# EasyEDA Pro project FKM3.epro, board PCB_OLD
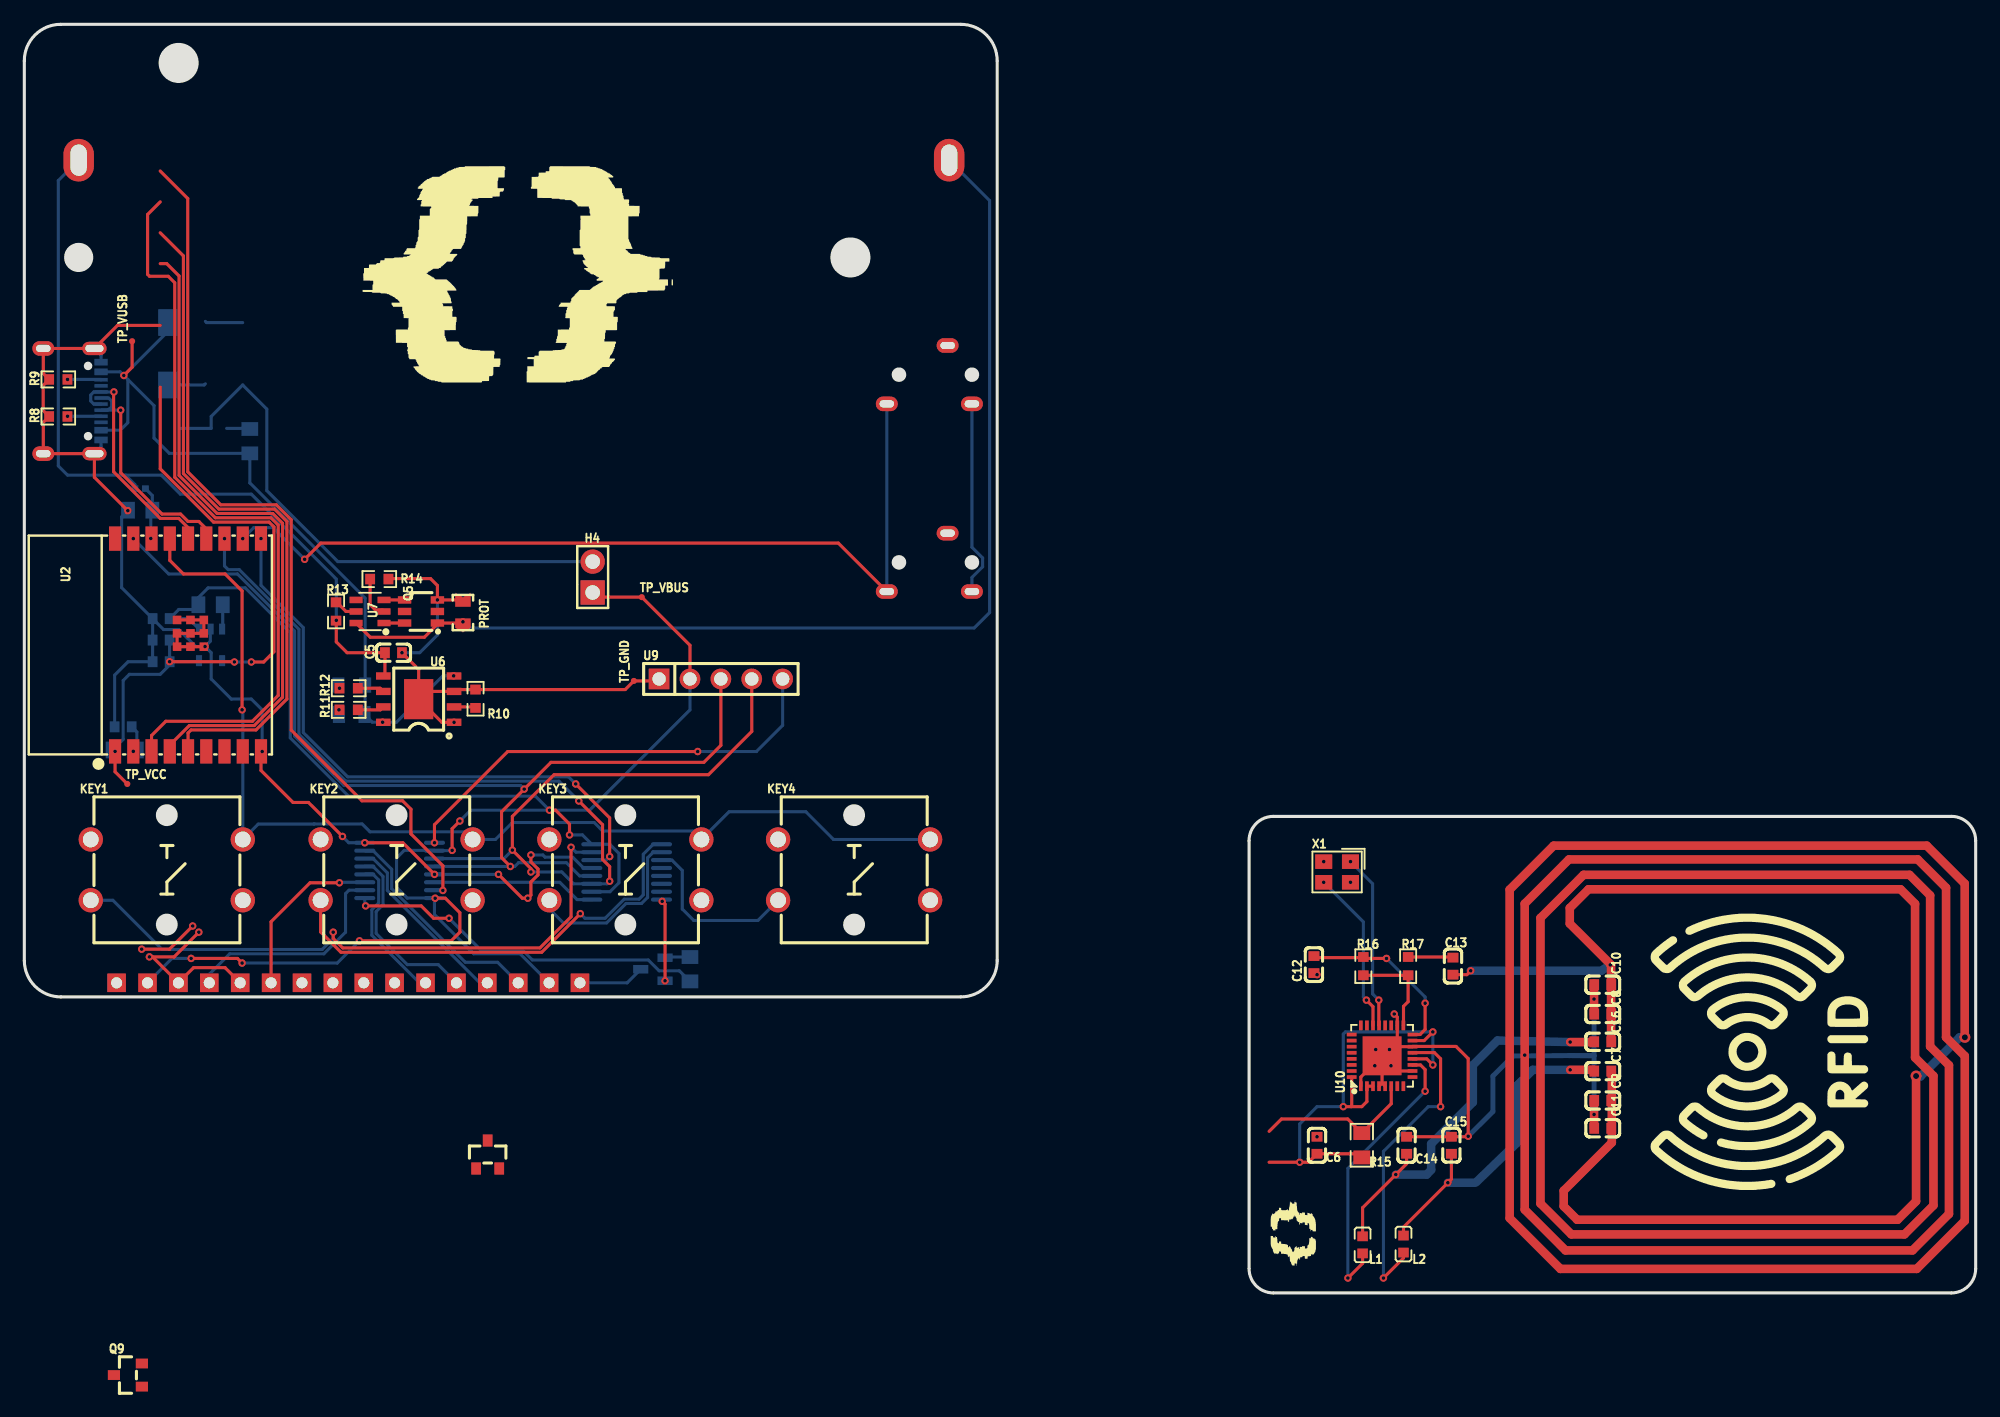
[diagram p17: board, top side]
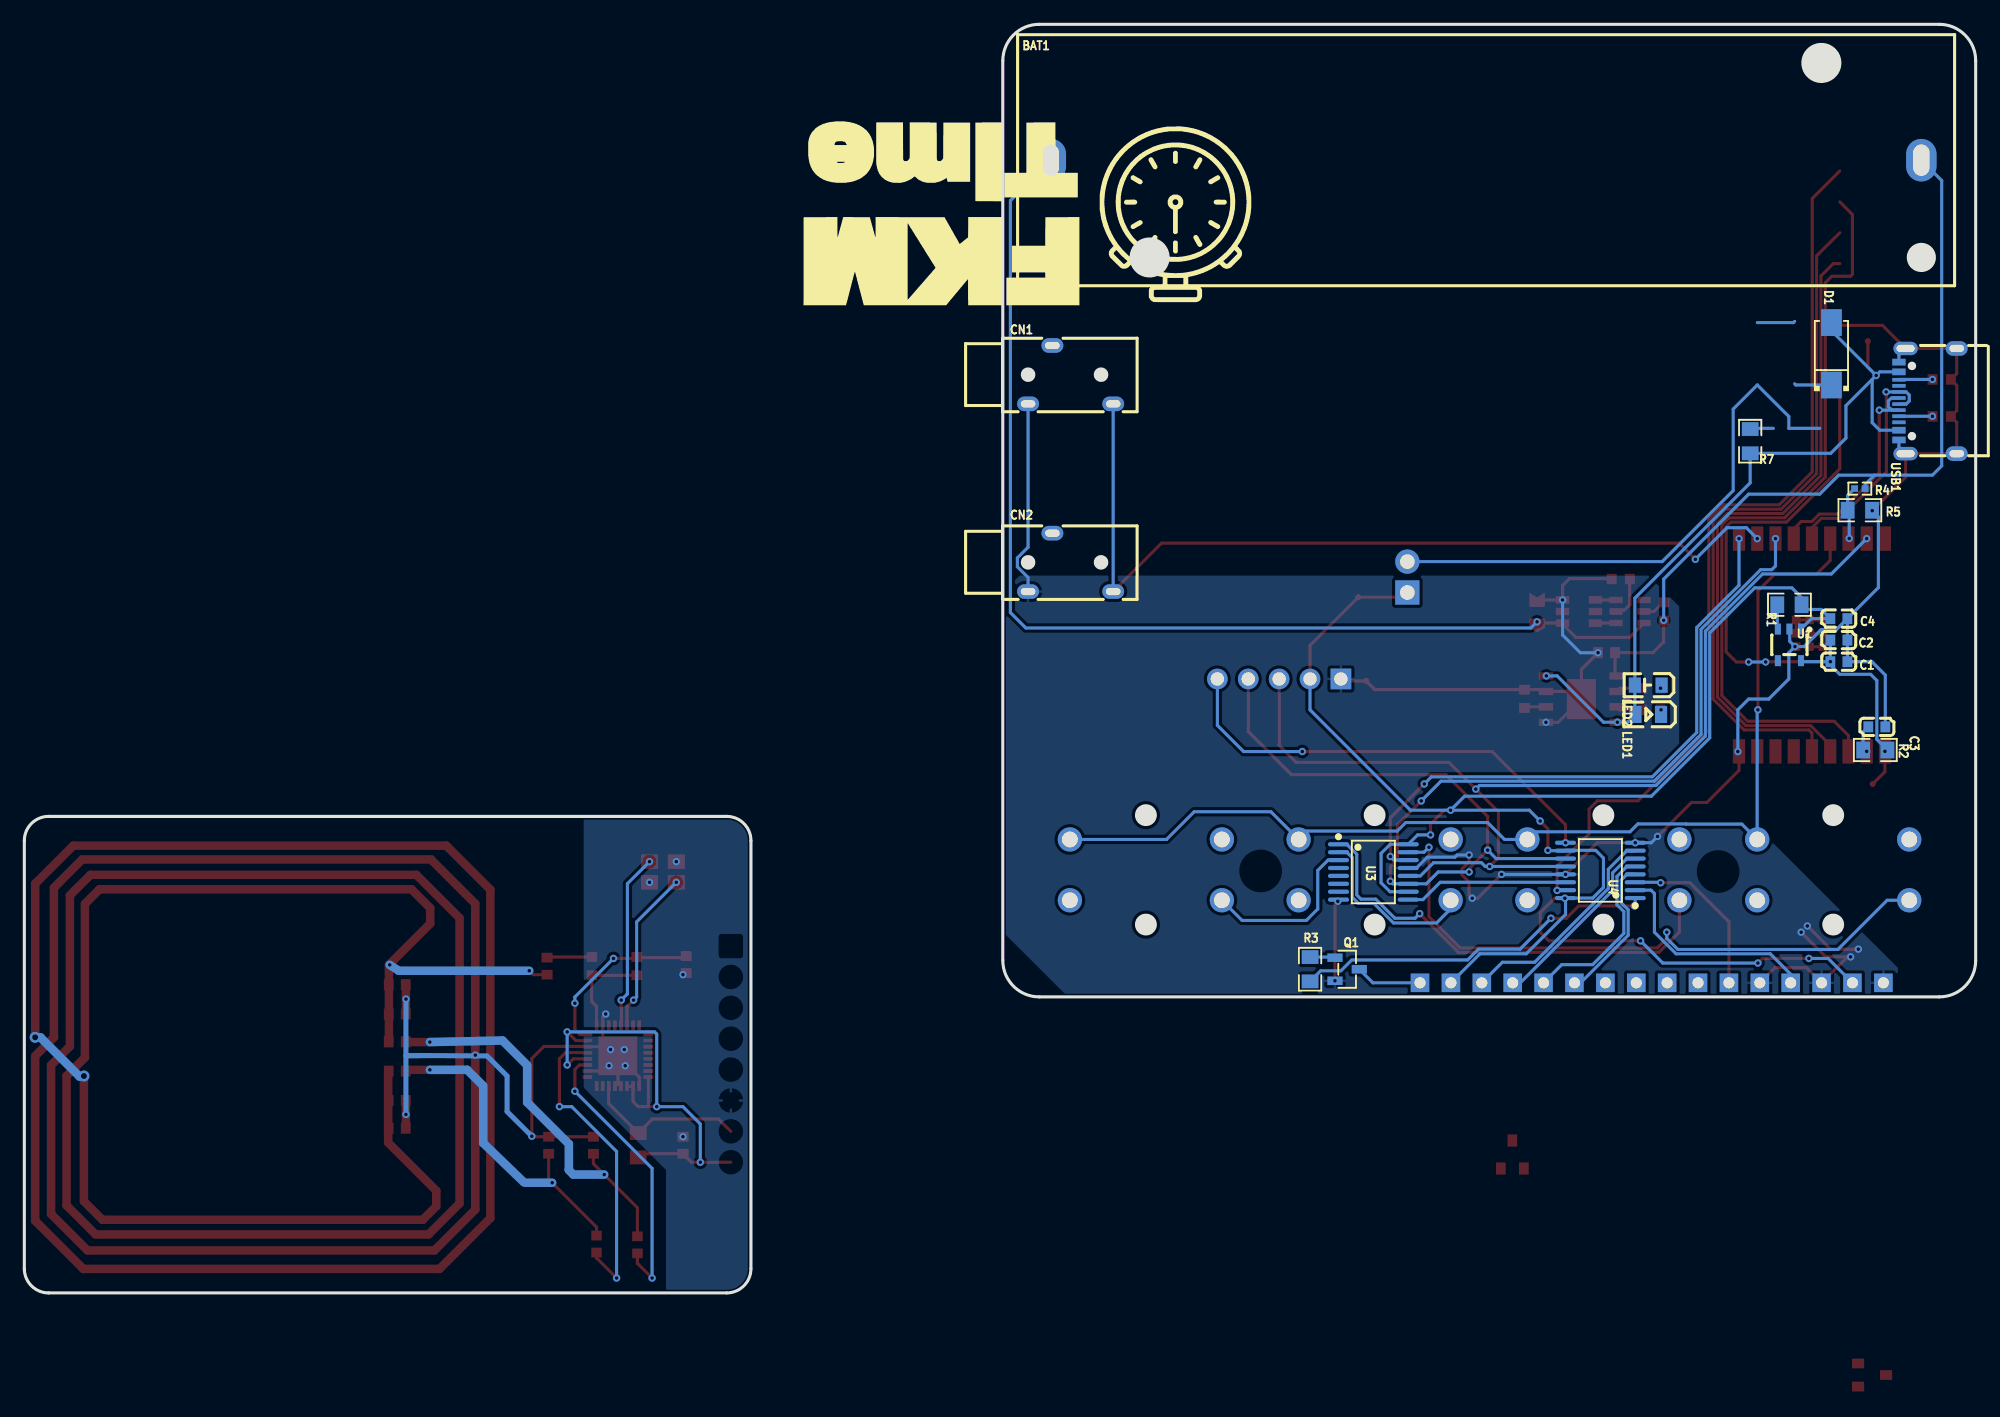
[diagram p18: board, bottom side, seen from below]

Outline 160.46 x 104.35 mm; copper layers: Top Layer, Bottom Layer. Coordinates in mm from the lower left corner of the outline.
Outline path: 0,101.35 0,27.35 arc(0.88,25.23) 3,24.35 77,24.35 arc(79.12,25.23) 80,27.35 80,101.35 arc(79.12,103.47) 77,104.35 3,104.35 arc(0.88,103.47) 0,101.35 ; 100.71,37.2 100.71,2 arc(101.3,0.59) 102.71,0 158.46,0 arc(159.88,0.59) 160.46,2 160.46,37.2 arc(159.88,38.61) 158.46,39.2 102.71,39.2 arc(101.3,38.61) 100.71,37.2
Stack: Top Layer 0.035mm / Dielectric1 1.51mm FR4 er 4.5 / Bottom Layer 0.035mm

## Design rules (mm)
template: JLCPCB Capability(Two Layers Board)
spacing copperThickness1oz (default): track to track 0.102, other pairs 0.152 to 0.3
spacing copperThickness2oz: track to track 0.203, other pairs 0.152 to 0.3
track width copperThickness1oz (default): min 0.127, default 0.254, max 2.54
track width copperThickness2oz: min 0.203, default 0.254, max 2.54
differential pair differentialPair (default): width min 0.127, default 0.254, max 2.54; gap min 0.152, default 0.152
via viaSize (default): diameter min 0.5, default 0.61, max 10; hole min 0.3, default 0.305, max 6.3

## Placement (name value [footprint] x y rotation side)
BAT1  BH-18650-A6AJ003  [BAT-TH_BH-18650-A5BJ003]  40.26 93.18 180 bottom
C1  10uF  [C0603]  11.25 51.92 180 bottom
C2  100nF  [C0603]  11.25 53.7 180 bottom
C3  1uF  [C0603]  8.13 46.57 0 bottom
C4  10uF  [C0603]  11.25 55.47 180 bottom
C5  10uF  [C0603]  30.35 52.66 180 top
C6  100nF  [C0603]  106.3 12.15 90 top
C7  15pF  [C0603]  129.79 18.25 0 top
C8  15pF  [C0603]  129.79 22.94 0 top
C9  180pF  [C0603]  129.79 15.83 0 top
C10  180pF  [C0603]  129.79 25.36 0 top
C11  10pF  [C0603]  129.79 13.55 0 top
C12  10pF  [C0603]  106.05 27.01 90 top
C13  100nF  [C0603]  117.48 26.88 270 top
C14  100nF  [C0603]  113.67 12.15 90 top
C15  47pF  [C0603]  117.35 12.15 90 top
C16  47pF  [C0603]  129.79 20.66 0 top
CN1  PJ-3200  [AUDIO-TH_PJ-3200]  74.42 75.53 180 bottom
CN2  PJ-3200  [AUDIO-TH_PJ-3200]  74.42 60.09 180 bottom
D1  SS14  [SMA_L4.2-W2.6-LS5.3-RD]  11.86 77.25 90 bottom
H1  -  [LCD16x2 edge connector]  7.59 25.51 0 top
H4  PW  [HDR-TH_2P-P2.54-V-M]  46.74 58.89 90 top
KEY1  B3F-4055  [KEY-TH_4P-L12.0-W12.0-P5.00-LS13.4-EH]  11.72 34.8 0 top
KEY2  B3F-4055  [KEY-TH_4P-L12.0-W12.0-P5.00-LS13.4-EH]  30.61 34.8 0 top
KEY3  B3F-4055  [KEY-TH_4P-L12.0-W12.0-P5.00-LS13.4-EH]  49.42 34.8 0 top
KEY4  B3F-4055  [KEY-TH_4P-L12.0-W12.0-P5.00-LS13.4-EH]  68.23 34.8 0 top
L1  2.2uH  [L0603]  110.05 3.96 90 top
L2  2.2uH  [L0603]  113.41 4.02 90 top
LED1  KT-0805G  [LED0805-R-RD]  26.92 47.58 0 bottom
LED2  LTST-C170TBKT  [LED0805-RD_BLUE]  26.92 50 0 bottom
PROT  SOLDERING JUMPER  [JUMPER]  36.07 57.23 90 top
Q1  MMBT3904  [SOT-23-3_L2.9-W1.3-P1.90-LS2.4-BR]  51.69 26.63 0 bottom
Q5  FS8205A  [SOT-23-6_L2.9-W1.6-P0.95-LS2.8-BR]  32.62 56.05 0 top
Q7  AO3401A  [SOT-23_L2.9-W1.3-P1.90-LS2.4-BR]  38.1 11.39 270 top
Q9  AO3401A  [SOT-23_L2.9-W1.3-P1.90-LS2.4-BR]  8.52 -6.75 0 top
R1  10kΩ  [R0805]  15.31 56.61 180 bottom
R2  10kΩ  [R0805]  8.26 44.66 0 bottom
R3  10kΩ  [R0805]  54.73 26.63 90 bottom
R4  6.8kΩ  [R0402]  9.53 66.16 0 bottom
R5  10kΩ  [R0805]  9.53 64.38 180 bottom
R7  10kΩ  [R0805]  18.54 70.06 90 bottom
R8  5100  [R0603]  2.79 72.09 0 top
R9  5100  [R0603]  2.79 75.14 0 top
R10  1.2k  [R0603]  37.1 48.88 90 top
R11  1k  [R0603]  26.67 47.96 0 top
R12  1k  [R0603]  26.67 49.74 0 top
R13  100  [R0603]  25.63 56.05 270 top
R14  1k  [R0603]  29.19 58.72 180 top
R15  10kΩ  [R0805]  109.98 12.15 90 top
R16  5.1kΩ  [R0603]  110.11 26.88 270 top
R17  820Ω  [R0603]  113.79 26.88 90 top
TP_GND  -  [Test-Point-0.5mm]  50.12 50.34 90 top
TP_VBUS  -  [Test-Point-0.5mm]  50.77 57.23 0 top
TP_VCC  -  [Test-Point-0.5mm]  8.47 41.87 0 top
TP_VUSB  -  [Test-Point-0.5mm]  8.86 78.28 90 top
U1  AP7366-33W5-7  [SOT-25_L3.0-W1.6-P0.95-LS2.8-BL]  15.31 53.31 0 bottom
U2  2.4GHz  [BULETM-SMD_ESPRESSIF_ESP32-C3-WROOM-02-N4-4MB]  13.46 53.3 90 top
U3  74HC595PW,118  [TSSOP-16_L5.0-W4.4-P0.65-LS6.4-BL]  49.53 34.63 270 bottom
U4  74HC595PW,118  [TSSOP-16_L5.0-W4.4-P0.65-LS6.4-BL]  30.86 34.76 90 bottom
U6  TP4056  [ESOP-8_L4.9-W3.9-P1.27-LS6.0-BL-EP]  32.43 48.84 90 top
U7  DW01A  [SOT-23-6_L2.9-W1.6-P0.95-LS2.8-BL]  28.43 56.05 90 top
U9  HB-PH3-25415PB2GOP  [HDR-TH_5P-P2.54-V-M]  57.28 50.5 0 top
U10  13.56MHz  [QFN-32_L5.0-W5.0-P0.50-TL-EP3.1]  111.65 19.51 90 top
USB1  TYPE-C 16PIN 2MD(073)  [USB-C-SMD_TYPE-C-6PIN-2MD-073]  3.94 73.36 90 bottom
X1  27.12MHz  [CRYSTAL-SMD_4P-L3.2-W2.5-BL]  107.95 34.63 180 top

## Footprints (pads in the part's own frame, mm; a bottom-side part is the same pattern mirrored in y, then rotated)
AUDIO-TH_PJ-3200
  oval 1.8x1.2 hole 1.2x0.6: 2(-1.5,2.4) 3(-3.5,-2.4) 4(3.5,-2.4)
BAT-TH_BH-18650-A5BJ003
  oval 2.5x3.5 hole 1.34x2.58: 1(-35.79,0) 2(35.79,0)
BULETM-SMD_ESPRESSIF_ESP32-C3-WROOM-02-N4-4MB
  rect 2x1 smd: 1(-8.75,6) 2(-8.75,4.5) 3(-8.75,3) 4(-8.75,1.5) 5(-8.75,0) 6(-8.75,-1.5) 7(-8.75,-3) 8(-8.75,-4.5) 9(-8.75,-6) 10(8.75,-6) 11(8.75,-4.5) 12(8.75,-3) 13(8.75,-1.5) 14(8.75,0) 15(8.75,1.5) 16(8.75,3) 17(8.75,4.5) 18(8.75,6)
  rect 0.7x0.7 smd: 19(-0.14,0.9) 19(-0.14,-0.2) 19(-0.14,-1.3) 19(0.96,0.9) 19(0.96,-0.2) 19(0.96,-1.3) 19(2.06,0.9) 19(2.06,-0.2) 19(2.06,-1.3)
C0603
  rect 0.8x0.9 smd: 1(-0.7,0) 2(0.7,0)
CRYSTAL-SMD_4P-L3.2-W2.5-BL
  rect 1.4x1.2 smd: 1(-1.1,-0.85) 2(1.1,-0.85) 3(1.1,0.85) 4(-1.1,0.85)
ESOP-8_L4.9-W3.9-P1.27-LS6.0-BL-EP
  rect 0.6x1.2 smd: 1(-1.905,-2.909) 2(-0.635,-2.909) 3(0.635,-2.909) 4(1.905,-2.909) 5(1.905,2.909) 6(0.635,2.909) 7(-0.635,2.909) 8(-1.905,2.909)
  rect 3.3x2.4 smd: 9(0,0)
HDR-TH_2P-P2.54-V-M
  rect 2x2 hole 1.2: 1(-1.27,0)
  round 2 hole 1.2: 2(1.27,0)
HDR-TH_5P-P2.54-V-M
  rect 1.7x1.7 hole 1.1: 1(-5.08,0)
  round 1.7 hole 1.1: 2(-2.54,0) 3(0,0) 4(2.54,0) 5(5.08,0)
JUMPER
  custom 1.143x1.27 smd: 1(-2.134,0) 2(-0.406,0)
KEY-TH_4P-L12.0-W12.0-P5.00-LS13.4-EH
  round 2 hole 1.3: 1(6.25,-2.5) 2(-6.25,-2.5) 3(6.25,2.5) 4(-6.25,2.5)
L0603
  rect 0.8x0.864 smd: 1(-0.7,0) 2(0.7,0)
LCD16x2 edge connector
  rect 1.524x1.524 hole 0.914x0.914: 1(0,0) 3(5.08,0) 4(7.62,0) 5(10.16,0) 6(12.7,0) 7(15.24,0) 8(17.78,0) 9(20.32,0) 10(22.86,0) 11(25.4,0) 12(27.94,0) 13(30.48,0) 14(33.02,0) 15(35.56,0) 16(38.1,0)
  rect 1.524x1.524 hole 0.914x1: 2(2.54,0)
LED0805-R-RD
  rect 1x1.399 smd: 1(1.05,0) 2(-1.05,0)
LED0805-RD_BLUE
  rect 1x1.25 smd: 1(-1.1,0) 2(1.1,0)
QFN-32_L5.0-W5.0-P0.50-TL-EP3.1
  rect 0.8x0.3 smd: 1(-2.5,1.75) 2(-2.5,1.25) 3(-2.5,0.75) 4(-2.5,0.25) 5(-2.5,-0.25) 6(-2.5,-0.75) 7(-2.5,-1.25) 8(-2.5,-1.75) 17(2.5,-1.75) 18(2.5,-1.25) 19(2.5,-0.75) 20(2.5,-0.25) 21(2.5,0.25) 22(2.5,0.75) 23(2.5,1.25) 24(2.5,1.75)
  rect 0.3x0.8 smd: 9(-1.75,-2.5) 10(-1.25,-2.5) 11(-0.75,-2.5) 12(-0.25,-2.5) 13(0.25,-2.5) 14(0.75,-2.5) 15(1.25,-2.5) 16(1.75,-2.5) 25(1.75,2.5) 26(1.25,2.5) 27(0.75,2.5) 28(0.25,2.5) 29(-0.25,2.5) 30(-0.75,2.5) 31(-1.25,2.5) 32(-1.75,2.5)
  rect 3.2x3.2 smd: 33(0,0)
R0402
  rect 0.566x0.54 smd: 1(-0.433,0) 2(0.433,0)
R0603
  rect 0.806x0.864 smd: 1(-0.753,0) 2(0.753,0)
R0805
  rect 1.133x1.377 smd: 1(-1,0) 2(1,0)
SMA_L4.2-W2.6-LS5.3-RD
  rect 2.2x1.7 smd: 1(-2.566,0) 2(2.566,0)
SOT-23-3_L2.9-W1.3-P1.90-LS2.4-BR
  rect 1.25x0.7 smd: 1(1,-0.95) 2(1,0.95) 3(-1,0)
SOT-23-6_L2.9-W1.6-P0.95-LS2.8-BL
  rect 0.532x1.072 smd: 1(-0.95,-1.149) 2(0,-1.149) 3(0.95,-1.149) 4(0.95,1.149) 5(0,1.149) 6(-0.95,1.149)
SOT-23-6_L2.9-W1.6-P0.95-LS2.8-BR
  rect 1.1x0.6 smd: 1(1.35,-0.95) 2(1.35,0) 3(1.35,0.95) 4(-1.35,0.95) 5(-1.35,0) 6(-1.35,-0.95)
SOT-23_L2.9-W1.3-P1.90-LS2.4-BR
  rect 1x0.8 smd: 1(1.15,-0.95) 2(1.15,0.95) 3(-1.15,0)
SOT-25_L3.0-W1.6-P0.95-LS2.8-BL
  rect 0.5x0.9 smd: 1(-0.95,-1.3) 2(0,-1.3) 3(0.95,-1.3) 4(0.95,1.3) 5(-0.95,1.3)
Test-Point-0.5mm
  round 0.5 smd: 1(0,0)
TSSOP-16_L5.0-W4.4-P0.65-LS6.4-BL
  oval 0.343x1.732 smd: 1(-2.275,-2.866) 2(-1.625,-2.866) 3(-0.975,-2.866) 4(-0.325,-2.866) 5(0.325,-2.866) 6(0.975,-2.866) 7(1.625,-2.866) 8(2.275,-2.866) 9(2.275,2.866) 10(1.625,2.866) 11(0.975,2.866) 12(0.325,2.866) 13(-0.325,2.866) 14(-0.975,2.866) 15(-1.625,2.866) 16(-2.275,2.866)
USB-C-SMD_TYPE-C-6PIN-2MD-073
  rect 0.55x1.1 smd: 1(-3.2,2.375) 2(-2.4,2.375) 11(2.4,2.375) 12(3.2,2.375)
  rect 0.3x1.1 smd: 3(-1.75,2.375) 4(-1.25,2.375) 5(-0.75,2.375) 6(-0.25,2.375) 7(0.25,2.375) 8(0.75,2.375) 9(1.25,2.375) 10(1.75,2.375)
  oval 1.2x1.8 hole 0.6x1.2: 13(-4.325,-2.375) 14(4.325,-2.375)
  oval 1.1x2 hole 0.6x1.5: 13(-4.325,1.825) 14(4.325,1.825)

## Nets
GND: C1.2 C2.2 C3.1 C4.2 C5.1 C7.2 C8.2 C9.1 C9.2 C10.1 C10.2 C11.1 C11.2 C12.1 C12.2 C13.2 C14.2 C15.2 C16.1 CN1.3 CN2.3 H1.1 H1.3 H1.5 PROT.2 Q1.2 Q5.3 Q9.1 R5.2 R8.1 R9.1 R10.2 R14.1 TP_GND.1 U1.2 U2.9 U2.19 U3.8 U3.13 U4.8 U4.13 U6.1 U6.3 U6.9 U9.1 U10.1 U10.4 U10.5 U10.10 U10.14 U10.18 U10.33 USB1.1 USB1.12 USB1.13 USB1.14 X1.2 X1.4
VBUS: C4.1 H1.2 H1.15 Q9.3 R1.2 TP_VBUS.1 U1.1 U3.10 U3.16 U4.10 U4.16 U9.2
VCC: C1.1 C2.1 R2.1 R15.1 TP_VCC.1 U1.5 U2.1 U10.2 U10.3 U10.12 U10.15 U10.32
B+: BAT1.2 C5.2 Q7.3 R4.1 R13.2 U6.5
B-: BAT1.1 C6.2 PROT.1 Q5.1 U7.6
BAT_SENS: R4.2 R5.1 U2.16
BTN_1: KEY1.2 U3.15
BTN_2: KEY2.2 U3.1
BTN_3: KEY3.2 U3.2
BTN_4: KEY4.2 U3.3
BTN_INP: KEY1.3 KEY2.3 KEY3.3 KEY4.3 U2.15
JACK: CN1.4 CN2.4 U2.11
LCD_BL: R3.1 U4.1
LCD_D4: H1.11 U4.4
LCD_D5: H1.12 U4.5
LCD_D6: H1.13 U4.6
LCD_D7: H1.14 U4.7
LCD_E: H1.6 U4.3
LCD_RS: H1.4 U4.2
RST: R15.2 U10.6
RX: R16.1 R17.2 U10.17
S_DS: U2.10 U3.14
S_OUT: U4.9 U9.5
S_SHCP: U2.12 U3.11 U4.11 U9.4
S_STCP: U2.17 U3.12 U4.12 U9.3
SPI_CS: U4.15 U10.24
SPI_MISO: U2.4 U10.31
SPI_MOSI: U2.5 U10.30
SPI_SCK: U2.3 U10.29
TX1: L1.1 U10.11
TX2: L2.1 U10.13
USB_D+: U2.14 USB1.6 USB1.8
USB_D-: U2.13 USB1.5 USB1.7
VMID: C13.1 R17.1 U10.16
VUSB: D1.2 LED1.1 LED2.2 R7.1 TP_VUSB.1 U6.4 U6.8 USB1.2 USB1.11
$1N383: R1.1 U1.3
$1N953: C3.2 R2.2 U2.2
$1N7305: U3.9 U4.14
$2N3153: Q1.1 R3.2
$2N3159: H1.16 Q1.3
$3N796: R9.2 USB1.10
$3N800: R8.2 USB1.4
$3N1470: C6.1 R13.1 U7.5
$3N1480: R11.2 U6.7
$3N1483: R12.2 U6.6
$3N1491: R10.1 U6.2
$3N1585: R14.2 U7.2
$3N1604: Q5.4 U7.3
$3N1608: Q5.6 U7.1
$3N3082: LED1.2 R11.1
$3N3173: LED2.1 R12.1
$3N11361: D1.1 H4.2 Q7.2
$3N11365: H4.1 Q9.2
$3N11375: Q7.1 R7.2
$5N1067: U10.21 X1.1
$5N1069: U10.22 X1.3
$5N1072: C14.1 R16.2
$5N1077: C8.1 C16.2 L2.2
$5N1078: C7.1 C15.1 L1.2

Pads without a net: CN1 2; CN2 2; H1 7 8 9 10; KEY1 1 4; KEY2 1 4; KEY3 1 4; KEY4 1 4; Q5 2 5; U1 4; U2 6 7 8 18; U3 4 5 6 7; U7 4; U10 7 8 9 19 20 23 25 26 27 28; USB1 3 9

## Via types
v1: diameter 0.61, hole 0.305, Top Layer to Bottom Layer, 99 vias
v2: diameter 0.9, hole 0.5, Top Layer to Bottom Layer, 2 vias

## Routing (per net, layer and track width the routed paths; a pad name or vN(x,y) marks a point on that pad's centre or on a via; arc(x,y) is an arc through that point)
GND: length 265.6
  Top Layer w0.254: U2.9 19.46,42.98 22.1,40.34 23.37,40.34 v1(26.16,37.55) ; 117.48,26.18 118.62,26.18 v1(118.94,26.5) ; U2.19 U2.19 U2.19 U2.19 U2.19 U2.19 U2.19 U2.19 U2.19 ; U10.1 109.9,17.76 U10.33 ; 112.4,20.26 U10.33 ; 112.4,20.26 112.9,20.76 112.9,22.69 v1(112.65,22.94) ; 112.4,20.26 U10.14 114.17,20.28 117.73,20.28 118.73,19.28 v1(118.73,12.89) 118.69,12.85 113.67,12.85 ; U10.33 111.65,17.26 ; U10.33 112.9,18.26 U10.10 ; U6.9 33.06,49.48 U6.3 35.49,49.63 49.41,49.63 TP_GND.1 52.04,50.34 U9.1 ; U6.9 34.33,46.94 v1(35.34,46.94) ; U6.9 32.43,51.29 v1(31.05,52.66) ; PROT.2 35.89,57 v1(33.97,57) 33.97,58.19 33.4,58.76 29.98,58.76 R14.1 ; v1(14.35,29.68) 12.32,27.64 10.54,27.64 ; v1(8.51,64.35) 5.76,67.09 USB1.13 USB1.13 1.56,71.61 R8.1 1.55,72.58 1.55,74.65 R9.1 1.56,75.62 USB1.14 USB1.14 7.66,79.59 11.18,79.59 ; v1(28,37.03) 31.13,37.03 v1(33.73,34.43) ; 113.41,4.72 113.41,5.42 v1(117.06,9.06) 117.35,9.36 117.35,11.45 ; v1(52.69,25.68) 52.69,31.98 v1(52.45,32.22) ; v1(9.65,28.28) 11.94,28.28 v1(13.84,30.18) ; 10.54,27.64 H1.3 13.92,26.75 16.51,26.75 H1.5 ; 10.54,27.64 v1(10.29,27.64) ; U10.5 111.65,17.26 ; 111.65,17.26 U10.4 ; v1(41.66,36.03) 41.66,35.45 42.24,34.87 42.24,34.39 41.66,33.8 41.66,32.72 v1(41.4,32.47) 40.95,32.47 v1(38.99,34.43)
  Top Layer w0.699: 129.08,18.35 v1(127.11,18.35)
  Bottom Layer w0.254: C3.1 7.43,50.82 8.53,51.92 C1.2 C2.2 10.55,53.7 C4.2 ; v1(26.16,37.55) 26.68,37.03 v1(28,37.03) ; U1.2 15.29,54.59 15.29,53.6 v1(14.86,53.17) ; v1(41.66,36.03) 42.64,36.03 42.82,35.85 45.09,35.85 45.98,34.95 U3.13 ; USB1.1 6.31,69.59 USB1.13 ; v1(19.56,44.53) 19.56,47.96 18.67,48.85 17.02,48.85 15.37,50.5 15.37,52.66 v1(14.86,53.17) ; C4.2 8,58.02 8,63.84 v1(8.51,64.35) ; C4.2 11.45,54.57 12.7,54.57 14.1,53.17 v1(14.86,53.17) ; v1(31.05,52.66) 32.51,52.66 33.97,54.12 v1(33.97,57) ; v1(33.73,34.43) v1(38.99,34.43) ; USB1.14 6.31,77.14 USB1.12 ; 77.92,73.13 77.92,61.34 78.8,60.46 78.8,59.73 77.92,58.85 CN2.3
  Bottom Layer w0.406: v1(129.08,14.68) 129.08,15.96 ; v1(129.08,24.17) 129.08,22.94
  Bottom Layer w0.699: 119.38,9.1 122.73,12.34 122.73,17.04 124.04,18.35 v1(127.11,18.35) ; v1(117.06,9.06) 119.25,9.06
  vias: v1(106.3,26.18) v1(106.85,35.48) v1(109.05,33.78) v1(111.05,18.69) v1(111.13,20.02) v1(112.25,20.02) v1(112.38,18.69) v1(123.38,19.56) v1(130.41,26.99) v2(155.56,17.84) v2(159.57,21.03)
VBUS: length 144.3
  Top Layer w0.254: v1(35.81,38.82) 35.18,38.18 v1(35.18,36.41) ; v1(43.18,39.71) 43.69,39.71 44.83,38.57 v1(44.83,37.68) ; v1(17.91,27.14) 17.53,27.52 v1(13.72,27.52) ; v1(27.56,28.96) 35.1,28.96 35.81,29.68 35.81,31.27 34.62,32.47 v1(33.78,32.47)
  Bottom Layer w0.254: H1.15 40.76,27.9 36.96,27.9 33.73,31.13 U4.16 31.49,32.48 30.61,33.36 30.61,35.77 31.24,36.41 33.7,36.41 U4.10 35.15,36.38 v1(35.18,36.41) ; v1(27.56,28.96) 25.73,27.14 v1(17.91,27.14) ; v1(13.72,27.52) 12.14,27.52 H1.2 ; U1.1 13.51,55.47 C4.1 12.7,56.22 13.92,56.22 R1.2 14.31,57.2 15.11,58 18.17,58 21.87,54.29 21.87,45.66 26.67,40.86 42.03,40.86 v1(43.18,39.71) ; v1(43.18,39.71) 36.7,39.71 v1(35.81,38.82) ; v1(43.18,39.71) 46.48,39.71 54.74,47.96 U9.2 ; v1(44.83,37.68) 45.89,37.68 U3.16 48.14,36.9 48.89,36.15 48.89,33.74 48.16,33 U3.10
VCC: length 93.1
  Top Layer w0.254: 102.36,10.75 v1(104.87,10.75) 105.6,10.75 106.3,11.45 ; U10.32 109.15,15.37 109.1,15.32 ; 109.1,15.32 109.98,15.32 110.4,15.74 U10.2 U10.3 ; 109.1,15.32 v1(108.46,15.32) ; v1(7.46,44.55) 7.46,42.87 TP_VCC.1 ; v1(115.82,18.75) 115.32,19.26 U10.12 ; v1(115.82,21.47) 115.11,20.76 U10.15 ; v1(17.27,51.9) 17.25,51.92 v1(11.95,51.92) ; 11.18,74.51 11.18,67.79 15.56,63.41 20.13,63.41 20.52,63.01 20.52,52.74 19.69,51.9 v1(18.67,51.9)
  Bottom Layer w0.254: v1(11.95,51.92) 14.28,51.92 U1.5 ; v1(11.95,51.92) C2.1 ; v1(11.95,51.92) 11.95,51.66 11.18,50.88 8.64,50.88 8.13,50.38 8.13,45.53 R2.1 ; v1(115.82,18.75) v1(115.82,21.47) 108.64,21.47 108.46,21.29 v1(108.46,15.32) 106.3,15.32 104.87,13.9 v1(104.87,10.75) ; v1(17.27,51.9) v1(18.67,51.9)
B+: length 65.5
  Top Layer w0.254: v1(25.65,55.33) 25.65,53.55 26.54,52.66 C5.2 29.65,50.88 U6.5
  Bottom Layer w0.254: v1(25.65,55.33) 25.65,58.72 18.67,65.71 12.83,65.71 11.27,67.27 8.32,67.27 ; 8.32,67.27 3.56,67.27 2.79,68.03 2.79,91.5 4.47,93.18 ; 8.32,67.27 9.09,66.5 R4.1
B-: length 92.4
  Top Layer w0.254: PROT.1 33.97,55.1 Q5.1 33.97,55.01 32.89,53.93 28.45,53.93 27.28,55.1
  Bottom Layer w0.254: v1(36.07,55.2) 36.58,54.69 78.11,54.69 79.38,55.96 79.38,89.85 BAT1.1
  vias: v1(106.3,12.85)
BAT_SENS: length 4.4
  Bottom Layer w0.254: R4.2 10.53,65.59 R5.1 10.4,64.26 v1(10.4,62.06)
BTN_1: length 51.5
  Top Layer w0.254: v1(25.4,29.68) 25.4,29.16 26.18,28.38 42.4,28.38 44.96,30.94 v1(44.96,36.66)
  Bottom Layer w0.254: KEY1.2 7.28,32.3 11.33,28.25 24.49,28.25 25.4,29.16 v1(25.4,29.68) ; U3.15 45.37,36.25 v1(44.96,36.66)
BTN_2: length 37.3
  Top Layer w0.254: v1(45.72,31.2) 42.55,28.02 26.03,28.02 24.36,29.7 KEY2.2
  Bottom Layer w0.254: U3.1 51.71,36.9 50.89,36.08 50.89,32.74 50.55,32.39 49.33,32.39 47.76,30.82 46.1,30.82 v1(45.72,31.2)
BTN_3: length 14.7
  Bottom Layer w0.254: KEY3.2 43.17,31.59 44.32,30.44 47.88,30.44 49.48,32.04 50.75,32.04 51.25,32.54 51.25,35.79 51.71,36.25 U3.2
BTN_4: length 14.2
  Bottom Layer w0.254: KEY4.2 60.32,30.64 55.04,30.64 54.1,31.58 54.1,34.76 53.25,35.6 U3.3
BTN_INP: length 89.9
  Top Layer w0.254: U2.15 11.96,60.26 13.08,59.14 16.51,59.14 17.91,57.74 v1(17.91,47.96)
  Bottom Layer w0.254: v1(17.91,47.96) 17.97,47.9 KEY1.3 19.23,38.57 23.82,38.57 23.83,38.58 27.78,38.58 28.43,37.93 36.23,37.93 KEY2.3 38.74,37.3 40.13,38.69 46.86,38.69 47.56,37.99 54.98,37.99 KEY3.3 57.95,39.58 64.26,39.58 66.54,37.3 KEY4.3
JACK: length 72.1
  Top Layer w0.254: v1(23.05,60.35) 24.38,61.68 66.94,61.68 CN2.4
  Bottom Layer w0.254: v1(23.05,60.35) 20.45,62.95 18.86,62.95 v1(17.96,62.05) ; 70.92,73.13 CN2.4
LCD_BL: length 29.9
  Top Layer w0.254: v1(28.07,31.83) 32.64,31.83 33.66,30.82 v1(34.92,30.82)
  Bottom Layer w0.254: v1(34.92,30.82) 37.47,28.28 40.89,28.28 41.78,27.39 51.31,27.39 52.2,26.5 53.86,26.5 R3.1 ; v1(28.07,31.83) 28,31.91 U4.1
LCD_D4: length 12.2
  Bottom Layer w0.254: U4.4 28.68,34.43 29.14,33.97 29.14,32.08 28.58,31.52 28.58,29.42 32.49,25.51 H1.11
LCD_D5: length 15
  Bottom Layer w0.254: U4.5 28.68,35.08 29.5,34.26 29.5,31.93 28.93,31.37 28.93,29.57 31.49,27.01 34.03,27.01 H1.12
LCD_D6: length 15.2
  Bottom Layer w0.254: U4.6 28.68,35.73 29.85,34.55 29.85,33.11 37.45,25.51 H1.13
LCD_D7: length 18.1
  Bottom Layer w0.254: H1.14 38.92,27.2 36.26,27.2 30.21,33.26 30.21,34.85 28.68,36.38 U4.7
LCD_E: length 14.1
  Top Layer w0.254: v1(25.91,33.74) 23.5,33.74 20.29,30.54 H1.6
  Bottom Layer w0.254: U4.3 25.95,33.78 v1(25.91,33.74)
LCD_RS: length 18.2
  Bottom Layer w0.254: H1.4 15.21,26.22 16.89,27.9 24.64,27.9 26.42,29.68 26.42,32.85 26.7,33.13 U4.2
RST: length 13.4
  Top Layer w0.254: U10.6 112.4,15.57 R15.2 108.82,14.31 103.38,14.31 102.36,13.29
RX: length 17.9
  Top Layer w0.254: 117.48,27.58 117.42,27.63 R17.2 ; 106.3,27.58 110.06,27.58 R16.1 110.23,27.52 v1(112.01,27.52) ; v1(115.19,23.83) 115.19,21.67 114.77,21.26 114.15,21.26
  Bottom Layer w0.254: v1(115.19,23.83) 115.19,24.34 v1(112.01,27.52)
S_DS: length 50.3
  Top Layer w0.254: v1(48.13,35.9) 48.13,39.07 v1(45.34,41.87)
  Bottom Layer w0.254: U3.14 47.84,35.6 v1(48.13,35.9) ; v1(19.46,62.05) 19.46,58.21 22.94,54.73 22.94,46.1 26.58,42.45 44.75,42.45 v1(45.34,41.87)
S_OUT: length 37.3
  Top Layer w0.254: v1(55.37,44.53) 39.75,44.53 33.73,38.51 v1(33.73,37.03)
  Bottom Layer w0.254: v1(55.37,44.53) 60.2,44.53 62.36,46.69 U9.5
S_SHCP: length 97.9
  Top Layer w0.254: v1(48.13,33.87) 48.13,35.07 47.55,35.66 47.55,38.51 v1(45.59,40.47) ; U9.4 59.82,46.19 56.26,42.63 43.56,42.63 40.13,39.2 v1(40.13,36.43) 41.66,34.9 v1(41.66,34.63)
  Bottom Layer w0.254: v1(48.13,33.87) 47.92,33.65 U3.11 45.17,33.65 44.2,34.63 v1(41.66,34.63) ; v1(45.59,40.47) 43.97,42.1 26.44,42.1 22.58,45.95 22.58,54.59 17.67,59.5 16.76,59.5 16.46,59.8 v1(16.46,62.05) ; U4.11 39.44,35.73 v1(40.13,36.43)
S_STCP: length 89.8
  Top Layer w0.254: v1(39.97,35.08) 39.24,35.8 39.24,39.58 v1(41.1,41.44) 43.31,43.65 55.88,43.65 57.28,45.04 U9.3
  Bottom Layer w0.254: v1(41.1,41.44) 40.81,41.74 26.29,41.74 22.23,45.8 22.23,54.44 17.53,59.14 11.87,59.14 v1(8.96,62.05) ; U4.12 v1(39.97,35.08) 40.33,35.08 40.64,35.39 44.58,35.39 45.66,34.3 U3.12
SPI_CS: length 74.1
  Top Layer w0.254: v1(34.42,33.11) 34.42,35.14 31.79,37.76 31.79,39.79 31.1,40.48 27.77,40.48 21.95,46.3 21.95,63.6 20.72,64.83 16.15,64.83 13.44,67.54 13.44,90.03 11.18,92.29
  Bottom Layer w0.254: U4.15 34.4,33.13 v1(34.42,33.11)
SPI_MISO: length 54.2
  Top Layer w0.254: 11.18,84.67 11.71,84.67 12.73,83.65 12.73,67.25 15.85,64.12 20.43,64.12 21.23,63.31 21.23,49 18.9,46.67 13.57,46.67 11.96,45.06 U2.4
SPI_MOSI: length 56.1
  Top Layer w0.254: 11.18,87.21 13.08,85.3 13.08,67.39 16,64.47 20.57,64.47 21.59,63.46 21.59,48.85 19.05,46.31 13.72,46.31 13.46,46.06 U2.5
SPI_SCK: length 62.1
  Top Layer w0.254: U2.3 10.46,45.85 11.63,47.02 18.76,47.02 20.88,49.15 20.88,63.16 20.28,63.76 15.71,63.76 12.37,67.1 12.37,83.09 11.84,83.62 10.3,83.62 10.14,83.79 10.14,88.71 11.18,89.75
TX1: length 23.5
  Top Layer w0.254: U10.11 114.15,18.75 114.81,18.75 115.19,18.37 v1(115.19,16.59) ; v1(108.84,1.23) 110.05,2.44 L1.1
  Bottom Layer w0.254: v1(115.19,16.59) 108.84,10.24 v1(108.84,1.23)
TX2: length 25.9
  Top Layer w0.254: v1(111.76,1.23) 113.41,2.88 L2.1 ; U10.13 114.16,19.77 115.95,19.77 116.46,19.26 v1(116.46,15.32)
  Bottom Layer w0.254: v1(116.46,15.32) 115.44,15.32 111.76,11.64 v1(111.76,1.23)
USB_D+: length 19
  Top Layer w0.254: v1(7.37,74.11) 7.34,74.09 7.34,67.55 11.18,63.71 12.7,63.71 13.46,62.95 U2.14
  Bottom Layer w0.254: USB1.6 5.72,73.11 5.46,73.37 5.46,73.86 5.72,74.11 USB1.8 v1(7.37,74.11)
USB_D-: length 18.4
  Top Layer w0.254: U2.13 14.96,62.85 14.35,63.46 13.46,63.46 12.85,64.07 11.32,64.07 7.92,67.47 v1(7.92,72.61)
  Bottom Layer w0.254: USB1.5 6.86,72.61 ; 6.86,72.61 v1(7.92,72.61) ; 6.86,72.61 6.93,72.68 6.98,72.68 7.19,72.89 7.19,73.36 6.94,73.61 USB1.7
VUSB: length 66.1
  Top Layer w0.254: v1(8.18,75.47) 8.86,76.15 TP_VUSB.1
  Bottom Layer w0.254: v1(35.31,50.76) 34.42,50.76 30.61,46.95 v1(29.46,46.95) 28.61,46.95 LED1.1 28.02,47.63 LED2.2 28.02,57.15 18.54,66.63 R7.1 11.92,69.06 10.67,70.32 10.67,72.98 8.51,75.14 ; 8.51,75.14 8.51,71.59 7.89,70.96 USB1.2 ; 8.51,75.14 v1(8.18,75.47) ; D1.2 11.86,79.14 v1(8.18,75.47) ; v1(8.18,75.47) 7.89,75.76 USB1.11
$1N383: length 2
  Bottom Layer w0.254: R1.1 16.31,54.66 U1.3
$1N953: length 2.1
  Bottom Layer w0.254: C3.2 9.26,46.14 R2.2
  vias: v1(8.96,44.55)
$1N7305: length 13.5
  Bottom Layer w0.254: 46.66,32.35 45.45,32.35 44.03,33.78 U4.14
$2N3153: length 2.1
  Bottom Layer w0.254: Q1.1 52.74,27.63 R3.2
$2N3159: length 5.5
  Bottom Layer w0.254: H1.16 49.57,25.51 Q1.3
$3N547: length 3.1
  Bottom Layer w0.254: 17.96,79.82 14.99,79.82 14.89,79.91
$3N796: length 2.8
  Bottom Layer w0.254: USB1.10 6.28,75.14 v1(3.56,75.14)
$3N800: length 2.8
  Bottom Layer w0.254: USB1.4 v1(3.56,72.11)
$3N1470: length 5.8
  Top Layer w0.254: C6.1 109.68,11.45 109.98,11.15 ; R13.1 25.7,56.81 26.45,56.05 27.28,56.05
$3N1480: length 2.2
  Top Layer w0.254: 27.42,48.09 27.55,47.96 29.28,47.96 U6.7
$3N1483: length 2.2
  Top Layer w0.254: R12.2 29.26,49.74 U6.6
$3N1491: length 1.8
  Top Layer w0.254: R10.1 37.02,48.21 U6.2
$3N1585: length 3.5
  Top Layer w0.254: R14.2 28.44,56.61 28.88,56.17 29.47,56.17 U7.2
$3N1604: length 1.7
  Top Layer w0.254: Q5.4 U7.3
$3N1608: length 1.7
  Top Layer w0.254: U7.1 Q5.6
$3N3082:
  vias: v1(25.87,47.96)
$3N3173:
  vias: v1(25.92,49.74)
$3N11361: length 49
  Bottom Layer w0.254: H4.2 25.78,60.16 19.94,66 19.94,72.7 17.96,74.69 15.37,72.1 15.37,71.12 12.83,71.12 ; 14.89,74.78 14.79,74.69 D1.1
$3N11365: length 12.6
  Top Layer w0.254: H4.1 47.12,57.23 50.77,57.23 54.74,53.27 54.74,50.5
$3N11375: length 1.9
  Bottom Layer w0.254: R7.2 18.49,71.12 16.64,71.12
$5N1067: length 14.4
  Top Layer w0.254: v1(111.38,24.09) 111.38,22.03 111.4,22.01
  Bottom Layer w0.254: v1(109.05,35.48) 110.87,33.66 110.87,24.59 v1(111.38,24.09)
$5N1069: length 13.4
  Top Layer w0.254: v1(110.36,24.09) 110.9,23.55 110.9,22.01
  Bottom Layer w0.254: v1(106.85,33.78) 110.11,30.52 110.11,24.34 v1(110.36,24.09)
$5N1072: length 40
  Top Layer w0.254: R16.2 113.79,26.13 113.79,23.96 113.41,23.58 113.41,22.02 113.4,22.01 ; 110.05,4.78 110.05,7.01 v1(112.78,9.74) 113.67,10.63 C14.1
  Top Layer w0.699: 129.08,20.64 v1(127.11,20.64)
  Bottom Layer w0.699: 115.68,10.16 115.68,12.25 119.11,15.68 119.11,18.73 121.14,20.76 v1(127.11,20.64) ; 115.7,10.12 115.32,9.74 v1(112.78,9.74)
$5N1077: length 533.5
  Top Layer w0.699: 129.08,22.92 129.08,25.46 ; 129.08,13.52 129.08,15.94
  Top Layer w0.7: 130.48,20.64 130.48,26.98 127.08,30.38 127.08,31.66 128.63,33.2 154.28,33.2 155.48,32.01 155.48,19.36 156.99,17.85 156.99,7.2 154.6,4.82 127.22,4.82 124.67,7.36 124.67,30.85 128.22,34.39 155.02,34.39 156.71,32.7 156.71,20.28 158.26,18.73 158.26,6.5 155.27,3.5 126.73,3.5 123.38,6.86 123.38,32.02 127.02,35.66 155.7,35.66 158.02,33.33 158.02,21.03 159.56,19.49 159.56,5.93 155.61,1.98 126.32,1.98 122.14,6.15 122.14,33.17 125.76,36.79 156.44,36.79 159.56,33.67 159.56,21.02 ; 130.54,18.22 130.54,12.37 126.59,8.41 126.59,7.13 127.7,6.02 154.04,6.02 155.56,7.54 155.56,17.84
  Bottom Layer w0.406: 118.73,12.89 120.76,14.92 120.76,17.84 122.41,19.49 127.03,19.52 ; 127.03,19.52 129.08,19.52 129.08,22.88 ; 127.03,19.52 129.08,19.51 129.08,15.99
  Bottom Layer w0.699: 118.94,26.5 129.67,26.5 130.41,26.99
  Bottom Layer w0.7: 155.55,17.8 155.91,17.8 159.14,21.03 159.54,21.03

## Copper pours and planes (outline as drawn; the poured copper is in the pictures)
GND on Bottom Layer: 100.71,39.2 114.46,39.2 114.46,16.88 107.7,10.12 107.7,0 100.71,0
GND on Bottom Layer: 6.39,24.35 74.64,24.35 80,29.71 80,57.62 78.61,59.01 26.92,59.01 24.38,56.47 24.38,44.73 6.39,26.74
